# Altium project STC15.PrjPcb
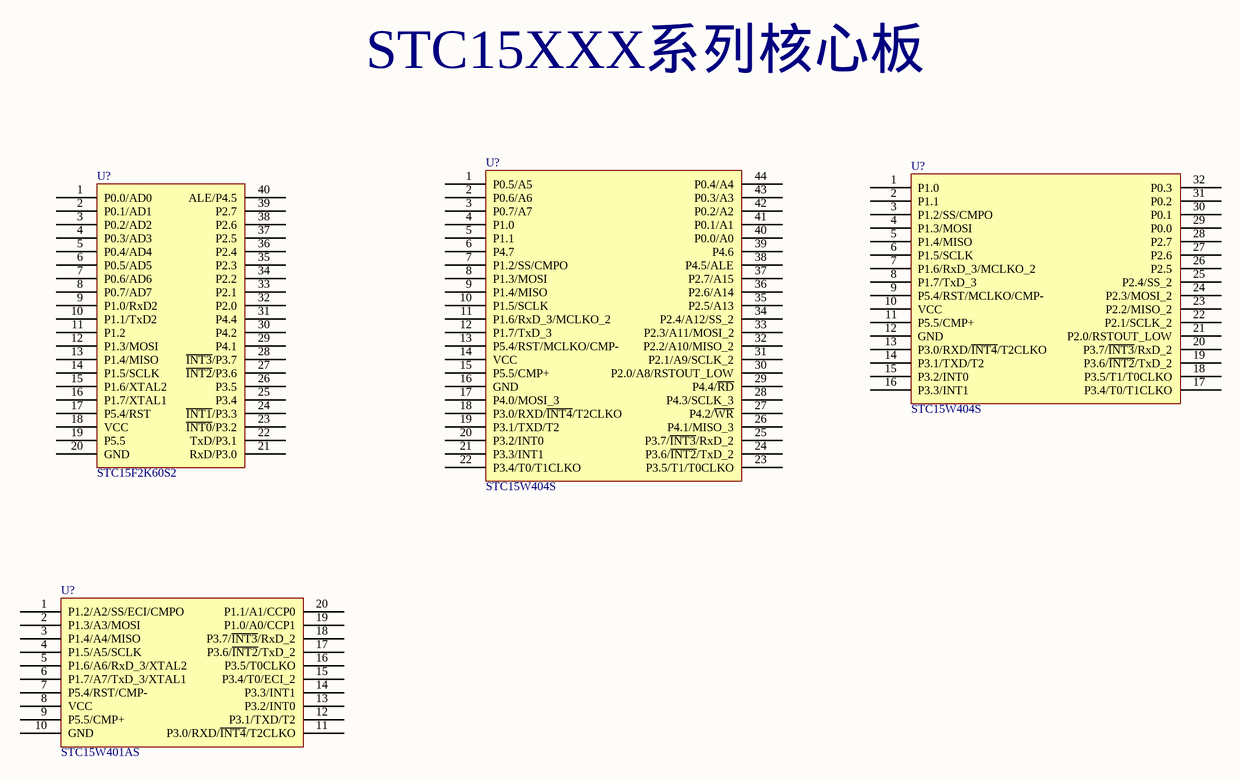
[diagram p0: STC15.SchDoc]
1 sheet, 4 parts. Net scope: global (net labels, ports and power ports of the same name join across sheets).
Board file: STC15.PcbDoc

## Sheet STC15.SchDoc
size A4; SheetNumber: 1; SheetTotal: 1

### Parts
(Parts that share a designator on the sheet are numbered #1, #2 ... from top to bottom, then left to right.)
U?#1  STC15W404S  [LQFP44 10x10_L]
U?#2  STC15W404S  [LQFP32 7x7_L]
U?#3  STC15F2K60S2  [DIP40-600_MH]
U?#4  STC15W401AS  [SOP20_L]

### Nets

Not connected (* = marked no-connect by the designer): U?#1 1(P0.5/A5) 2(P0.6/A6) 3(P0.7/A7) 4(P1.0) 5(P1.1) 6(P4.7) 7(P1.2/SS/CMPO) 8(P1.3/MOSI) 9(P1.4/MISO) 10(P1.5/SCLK) 11(P1.6/RxD_3/MCLKO_2) 12(P1.7/TxD_3) 13(P5.4/RST/MCLKO/CMP-) 14(VCC) 15(P5.5/CMP+) 16(GND) 17(P4.0/MOSI_3) 18(P3.0/RXD/~{INT4}/T2CLKO) 19(P3.1/TXD/T2) 20(P3.2/INT0) 21(P3.3/INT1) 22(P3.4/T0/T1CLKO) 23(P3.5/T1/T0CLKO) 24(P3.6/~{INT2}/TxD_2) 25(P3.7/~{INT3}/RxD_2) 26(P4.1/MISO_3) 27(P4.2/~{WR}) 28(P4.3/SCLK_3) 29(P4.4/~{RD}) 30(P2.0/A8/RSTOUT_LOW) 31(P2.1/A9/SCLK_2) 32(P2.2/A10/MISO_2) 33(P2.3/A11/MOSI_2) 34(P2.4/A12/SS_2) 35(P2.5/A13) 36(P2.6/A14) 37(P2.7/A15) 38(P4.5/ALE) 39(P4.6) 40(P0.0/A0) 41(P0.1/A1) 42(P0.2/A2) 43(P0.3/A3) 44(P0.4/A4); U?#2 1(P1.0) 2(P1.1) 3(P1.2/SS/CMPO) 4(P1.3/MOSI) 5(P1.4/MISO) 6(P1.5/SCLK) 7(P1.6/RxD_3/MCLKO_2) 8(P1.7/TxD_3) 9(P5.4/RST/MCLKO/CMP-) 10(VCC) 11(P5.5/CMP+) 12(GND) 13(P3.0/RXD/~{INT4}/T2CLKO) 14(P3.1/TXD/T2) 15(P3.2/INT0) 16(P3.3/INT1) 17(P3.4/T0/T1CLKO) 18(P3.5/T1/T0CLKO) 19(P3.6/~{INT2}/TxD_2) 20(P3.7/~{INT3}/RxD_2) 21(P2.0/RSTOUT_LOW) 22(P2.1/SCLK_2) 23(P2.2/MISO_2) 24(P2.3/MOSI_2) 25(P2.4/SS_2) 26(P2.5) 27(P2.6) 28(P2.7) 29(P0.0) 30(P0.1) 31(P0.2) 32(P0.3); U?#3 1(P0.0/AD0) 2(P0.1/AD1) 3(P0.2/AD2) 4(P0.3/AD3) 5(P0.4/AD4) 6(P0.5/AD5) 7(P0.6/AD6) 8(P0.7/AD7) 9(P1.0/RxD2) 10(P1.1/TxD2) 11(P1.2) 12(P1.3/MOSI) 13(P1.4/MISO) 14(P1.5/SCLK) 15(P1.6/XTAL2) 16(P1.7/XTAL1) 17(P5.4/RST) 18(VCC) 19(P5.5) 20(GND) 21(RxD/P3.0) 22(TxD/P3.1) 23(~{INT0}/P3.2) 24(~{INT1}/P3.3) 25(P3.4) 26(P3.5) 27(~{INT2}/P3.6) 28(~{INT3}/P3.7) 29(P4.1) 30(P4.2) 31(P4.4) 32(P2.0) 33(P2.1) 34(P2.2) 35(P2.3) 36(P2.4) 37(P2.5) 38(P2.6) 39(P2.7) 40(ALE/P4.5); U?#4 1(P1.2/A2/SS/ECI/CMPO) 2(P1.3/A3/MOSI) 3(P1.4/A4/MISO) 4(P1.5/A5/SCLK) 5(P1.6/A6/RxD_3/XTAL2) 6(P1.7/A7/TxD_3/XTAL1) 7(P5.4/RST/CMP-) 8(VCC) 9(P5.5/CMP+) 10(GND) 11(P3.0/RXD/~{INT4}/T2CLKO) 12(P3.1/TXD/T2) 13(P3.2/INT0) 14(P3.3/INT1) 15(P3.4/T0/ECI_2) 16(P3.5/T0CLKO) 17(P3.6/~{INT2}/TxD_2) 18(P3.7/~{INT3}/RxD_2) 19(P1.0/A0/CCP1) 20(P1.1/A1/CCP0)

### Notes on the sheet
- STC15XXX系列核心板

### Library data of the parts
U?#1 = STC15W40xS-44pin: STC单片机; 版权归属: 源创客; BOM名称: STC单片机; 学习资源: www.ooocke.com
U?#2 = STC15W40xS-32pin: STC单片机; 版权归属: 源创客; BOM名称: STC单片机; 学习资源: www.ooocke.com
U?#3 = STC15F2K60S2-40pin: STC单片机; 版权归属: 源创客; BOM名称: STC单片机; 学习资源: www.ooocke.com
U?#4 = STC15W40xAS-20pin: STC单片机; 版权归属: 源创客; BOM名称: STC单片机; 学习资源: www.ooocke.com